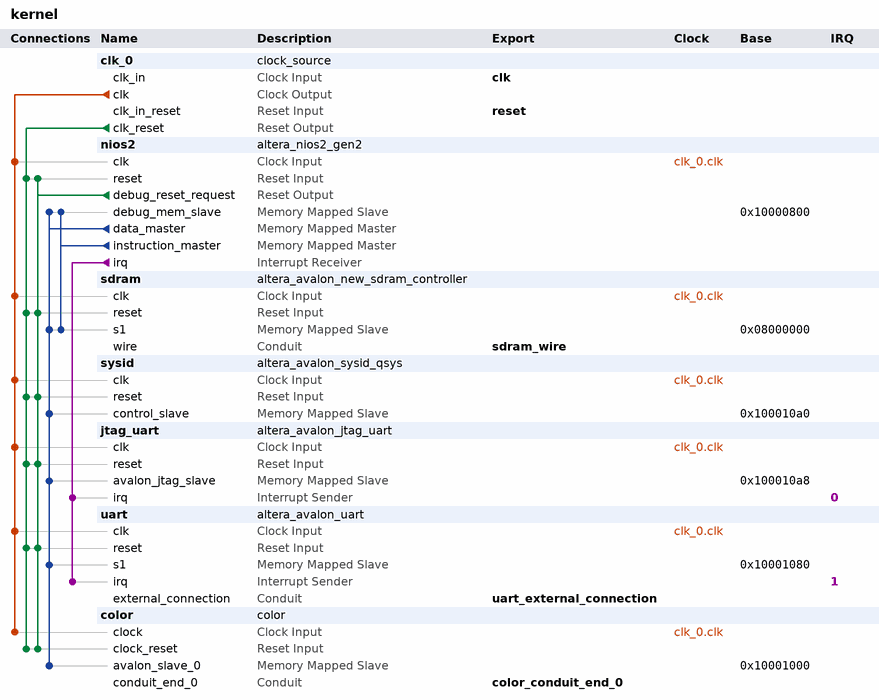
[diagram p0: system contents]
# Platform Designer (Qsys) system kernel, Cyclone IV E EP4CE115F29C7
# Parameters at their usual value, and those the tool derives, are not listed.
package require -exact qsys 15.0
create_system kernel
set_project_property DEVICE_FAMILY {Cyclone IV E}
set_project_property DEVICE EP4CE115F29C7

add_instance clk_0 clock_source 15.0
set_instance_parameter_value clk_0 clockFrequency 100000000

add_instance nios2 altera_nios2_gen2 15.0
set_instance_parameter_value nios2 dcache_size 0
set_instance_parameter_value nios2 debug_datatrigger 2
set_instance_parameter_value nios2 debug_hwbreakpoint 2
set_instance_parameter_value nios2 debug_traceType instruction_and_data_trace
set_instance_parameter_value nios2 exceptionSlave sdram.s1
set_instance_parameter_value nios2 icache_size 4096
set_instance_parameter_value nios2 impl Fast
set_instance_parameter_value nios2 resetSlave sdram.s1

add_instance sdram altera_avalon_new_sdram_controller 15.0
set_instance_parameter_value sdram TAC 5.5
set_instance_parameter_value sdram TRCD 20.0
set_instance_parameter_value sdram TRP 20.0
set_instance_parameter_value sdram casLatency 3
set_instance_parameter_value sdram columnWidth 10
set_instance_parameter_value sdram dataWidth 32
set_instance_parameter_value sdram generateSimulationModel false
set_instance_parameter_value sdram model single_Micron_MT48LC4M32B2_7_chip
set_instance_parameter_value sdram numberOfBanks 4
set_instance_parameter_value sdram numberOfChipSelects 1
set_instance_parameter_value sdram powerUpDelay 100.0
set_instance_parameter_value sdram refreshPeriod 15.625
set_instance_parameter_value sdram rowWidth 13

add_instance sysid altera_avalon_sysid_qsys 15.0
set_instance_parameter_value sysid id 0

add_instance jtag_uart altera_avalon_jtag_uart 15.0
set_instance_parameter_value jtag_uart simInteractiveOptions NO_INTERACTIVE_WINDOWS

add_instance uart altera_avalon_uart 15.0
set_instance_parameter_value uart baud 115200
set_instance_parameter_value uart dataBits 8
set_instance_parameter_value uart fixedBaud true
set_instance_parameter_value uart parity NONE
set_instance_parameter_value uart stopBits 1

add_instance color color 1.0
set_instance_parameter_value color BLUE 4
set_instance_parameter_value color FIN 5
set_instance_parameter_value color G2B 3
set_instance_parameter_value color GREEN 2
set_instance_parameter_value color PRE 6
set_instance_parameter_value color R2G 1
set_instance_parameter_value color RED 0
set_instance_parameter_value color WHITE_B 765
set_instance_parameter_value color WHITE_G 765
set_instance_parameter_value color WHITE_R 765

# connections
add_connection clk_0.clk color.clock clock
add_connection clk_0.clk jtag_uart.clk clock
add_connection clk_0.clk nios2.clk clock
add_connection clk_0.clk sdram.clk clock
add_connection clk_0.clk sysid.clk clock
add_connection clk_0.clk uart.clk clock
add_connection clk_0.clk_reset color.clock_reset reset
add_connection clk_0.clk_reset jtag_uart.reset reset
add_connection clk_0.clk_reset nios2.reset reset
add_connection clk_0.clk_reset sdram.reset reset
add_connection clk_0.clk_reset sysid.reset reset
add_connection clk_0.clk_reset uart.reset reset
add_connection nios2.debug_reset_request color.clock_reset reset
add_connection nios2.debug_reset_request jtag_uart.reset reset
add_connection nios2.debug_reset_request nios2.reset reset
add_connection nios2.debug_reset_request sdram.reset reset
add_connection nios2.debug_reset_request sysid.reset reset
add_connection nios2.debug_reset_request uart.reset reset
add_connection nios2.data_master color.avalon_slave_0 avalon
set_connection_parameter_value nios2.data_master/color.avalon_slave_0 baseAddress 0x10001000
add_connection nios2.data_master jtag_uart.avalon_jtag_slave avalon
set_connection_parameter_value nios2.data_master/jtag_uart.avalon_jtag_slave baseAddress 0x100010a8
add_connection nios2.data_master nios2.debug_mem_slave avalon
set_connection_parameter_value nios2.data_master/nios2.debug_mem_slave baseAddress 0x10000800
add_connection nios2.data_master sdram.s1 avalon
set_connection_parameter_value nios2.data_master/sdram.s1 baseAddress 0x08000000
add_connection nios2.data_master sysid.control_slave avalon
set_connection_parameter_value nios2.data_master/sysid.control_slave baseAddress 0x100010a0
add_connection nios2.data_master uart.s1 avalon
set_connection_parameter_value nios2.data_master/uart.s1 baseAddress 0x10001080
add_connection nios2.instruction_master nios2.debug_mem_slave avalon
set_connection_parameter_value nios2.instruction_master/nios2.debug_mem_slave baseAddress 0x10000800
add_connection nios2.instruction_master sdram.s1 avalon
set_connection_parameter_value nios2.instruction_master/sdram.s1 baseAddress 0x08000000
add_connection nios2.irq jtag_uart.irq interrupt
set_connection_parameter_value nios2.irq/jtag_uart.irq irqNumber 0
add_connection nios2.irq uart.irq interrupt
set_connection_parameter_value nios2.irq/uart.irq irqNumber 1

# exported interfaces
add_interface clk clock sink
set_interface_property clk EXPORT_OF clk_0.clk_in
add_interface color_conduit_end_0 conduit end
set_interface_property color_conduit_end_0 EXPORT_OF color.conduit_end_0
add_interface reset reset sink
set_interface_property reset EXPORT_OF clk_0.clk_in_reset
add_interface sdram_wire conduit end
set_interface_property sdram_wire EXPORT_OF sdram.wire
add_interface uart_external_connection conduit end
set_interface_property uart_external_connection EXPORT_OF uart.external_connection

set_interconnect_requirement {$system} qsys_mm.clockCrossingAdapter HANDSHAKE
set_interconnect_requirement {$system} qsys_mm.enableEccProtection FALSE
set_interconnect_requirement {$system} qsys_mm.insertDefaultSlave FALSE
set_interconnect_requirement {$system} qsys_mm.maxAdditionalLatency 1

save_system kernel.qsys
